# Altium project LED_PCB.PrjPcb
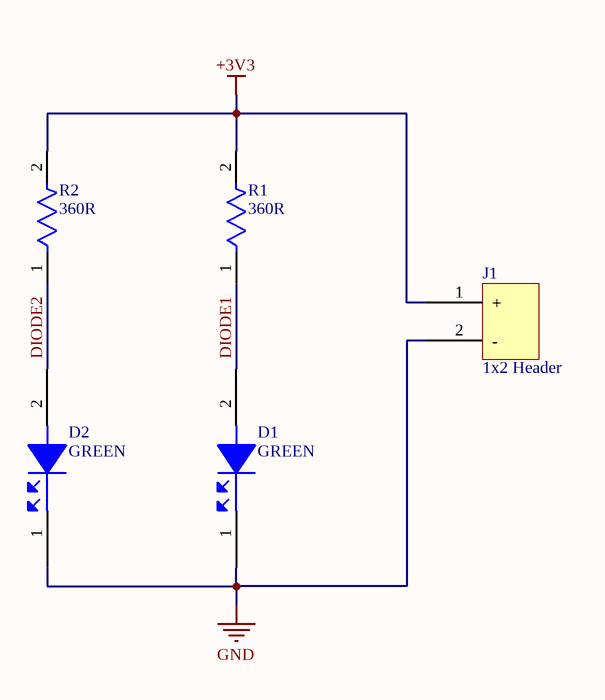
[diagram p0: LED.SchDoc]
1 sheet, 5 parts. Net scope: global (net labels, ports and power ports of the same name join across sheets).
Board file: LED.PcbDoc

## Sheet LED.SchDoc
size A; SheetNumber: 1; SheetTotal: 1

### Parts
D1  GREEN  [LED0603G]
D2  GREEN  [LED0603G]
J1  1x2 Header  [HDR1x2]
R1  360R  [R0805]
R2  360R  [R0805]

### Nets
+3V3: J1.1(+) R1.2 R2.2
GND: D1.1 D2.1 J1.2(-)
DIODE1: D1.2 R1.1
DIODE2: D2.2 R2.1

### Library data of the parts
D1 D2 = LSM0603453V: LED SM 0603 3V -/1000/-MCD GREEN; Manufacturer: Visual Communications; Lens Color: Colorless; Lens Style: Flat; Lens Transparency: Clear; Luminous Intensity: 63mcd; Forward Voltage: 2V; Test Current: 20mA; Viewing Angle: 120°; Dominant Wavelength: 572nm; Lens Size: 0.8mm; Supplier 1: Digi-Key; Supplier Part Number 1: LSM0603453VCT-ND; Manufacturer Part Number: LSM0603453V; RoHS: Yes; Category: LEDs; Stock 1: 90453; Pricing 1: 1=0.4, 10=0.247, 100=0.1421, 1000=0.11124, 2000=0.10197 (USD); Mount: Surface Mount; Case/Package: 0603; Color: Green; Case Code (Imperial): 0603; Case Code (Metric): 1608; Packaging: Cut Tape; Series: LSM0603; Length: 1.6mm; Width: 0.8mm; Height: 0.65mm; RoHS Compliant: Yes; ComponentLink1URL: http://www.farnell.com/datasheets/2699708.pdf?src-supplier=Farnell; ComponentLink1Description: http://www.farnell.com/datasheets/2699708.pdf?src-supplier=Farnell; ComponentLink2URL: http://www.farnell.com/datasheets/2699708.pdf?src-supplier=Newark; ComponentLink2Description: http://www.farnell.com/datasheets/2699708.pdf?src-supplier=Newark; ComponentLink3URL: https://vcclite.com/wp-content/uploads/wpallimport/files/files/LSM0603453V.pdf?src-supplier=Digi-Key; ComponentLink3Description: https://vcclite.com/wp-content/uploads/wpallimport/files/files/LSM0603453V.pdf?src-supplier=Digi-Key
J1 = 22-27-2021: CONN HEADER VERT 2POS 2.54MM; Manufacturer: Molex; Number of Positions: 2; Current Rating: 4A; Gender: Male; Voltage Rating: 500V; Voltage Rating (DC): 250V; Supplier 1: Digi-Key; Supplier Part Number 1: WM4111-ND; Manufacturer Part Number: 22-27-2021; RoHS: Yes; Category: Headers and Wire Housings; Stock 1: 143656; Pricing 1: 1=0.3, 10=0.245, 100=0.18, 1000=0.14317, 5000=0.12272, 10000=0.11453 (USD); Housing Color: Natural; Housing Material: Nylon; Contact Plating: Tin; Contact Material: Tin; Material: Nylon; Weight: 0.00769oz; Number of Rows: 1; Packaging: Bulk; Termination: Through Hole; Series: 6410; Package Quantity: 24000; Contact Type: -; Contact Gender: Male; Pitch: 2.54mm; RoHS Compliant: Yes; Lead Free: Lead Free; Flammability Rating: UL94 V-0
R1 R2 = 1029c3af85768c4190bb7ad29bc67b5: RES SMD 360 OHM 1% 1/8W 0805; Manufacturer: Yageo; Manufacturer Part Number: AC0805FR-07360RL; Voltage Rating: 150V; Resistance: 360Ω; Tolerance: 0.01; Automotive Grade: Grade 0; Value: 360Ω; Temperature Range Low: -55°C; Footprint Url: http://www.yageo.com/exep/pages/download/literatures/PYu-R_Mount_10.pdf; Power Rating: 1/8W; Automotive: Yes; Height: 0.6mm; Composition: Thick Film; Digikey Description: RES SMD 360 OHM 1% 1/8W 0805; Category: Res; Ipc Land Pattern Name: RESC200125X50; Device Class L3: Chip SMD Resistors; ComponentLink2URL: http://www.yageo.com/documents/recent/PYu-AC_51_RoHS_L_6.pdf; Octopart: https://octopart.com/ac0805fr-07360rl-yageo-71367690; Device Class L1: Passive Components; ComponentLink2Description: Datasheet; Device Class L2: Resistors; Lead Free: Yes; Series: AC; Temperature: -55°C to +155°C; RoHS: TRUE; Package: AC0805; Temperature Range High: +155°C